# Altium schematic sheet [12] - REFERENCE CLOCKS.SchDoc
size A3; DocumentNumber: 12; SheetNumber: 12; SheetTotal: 15
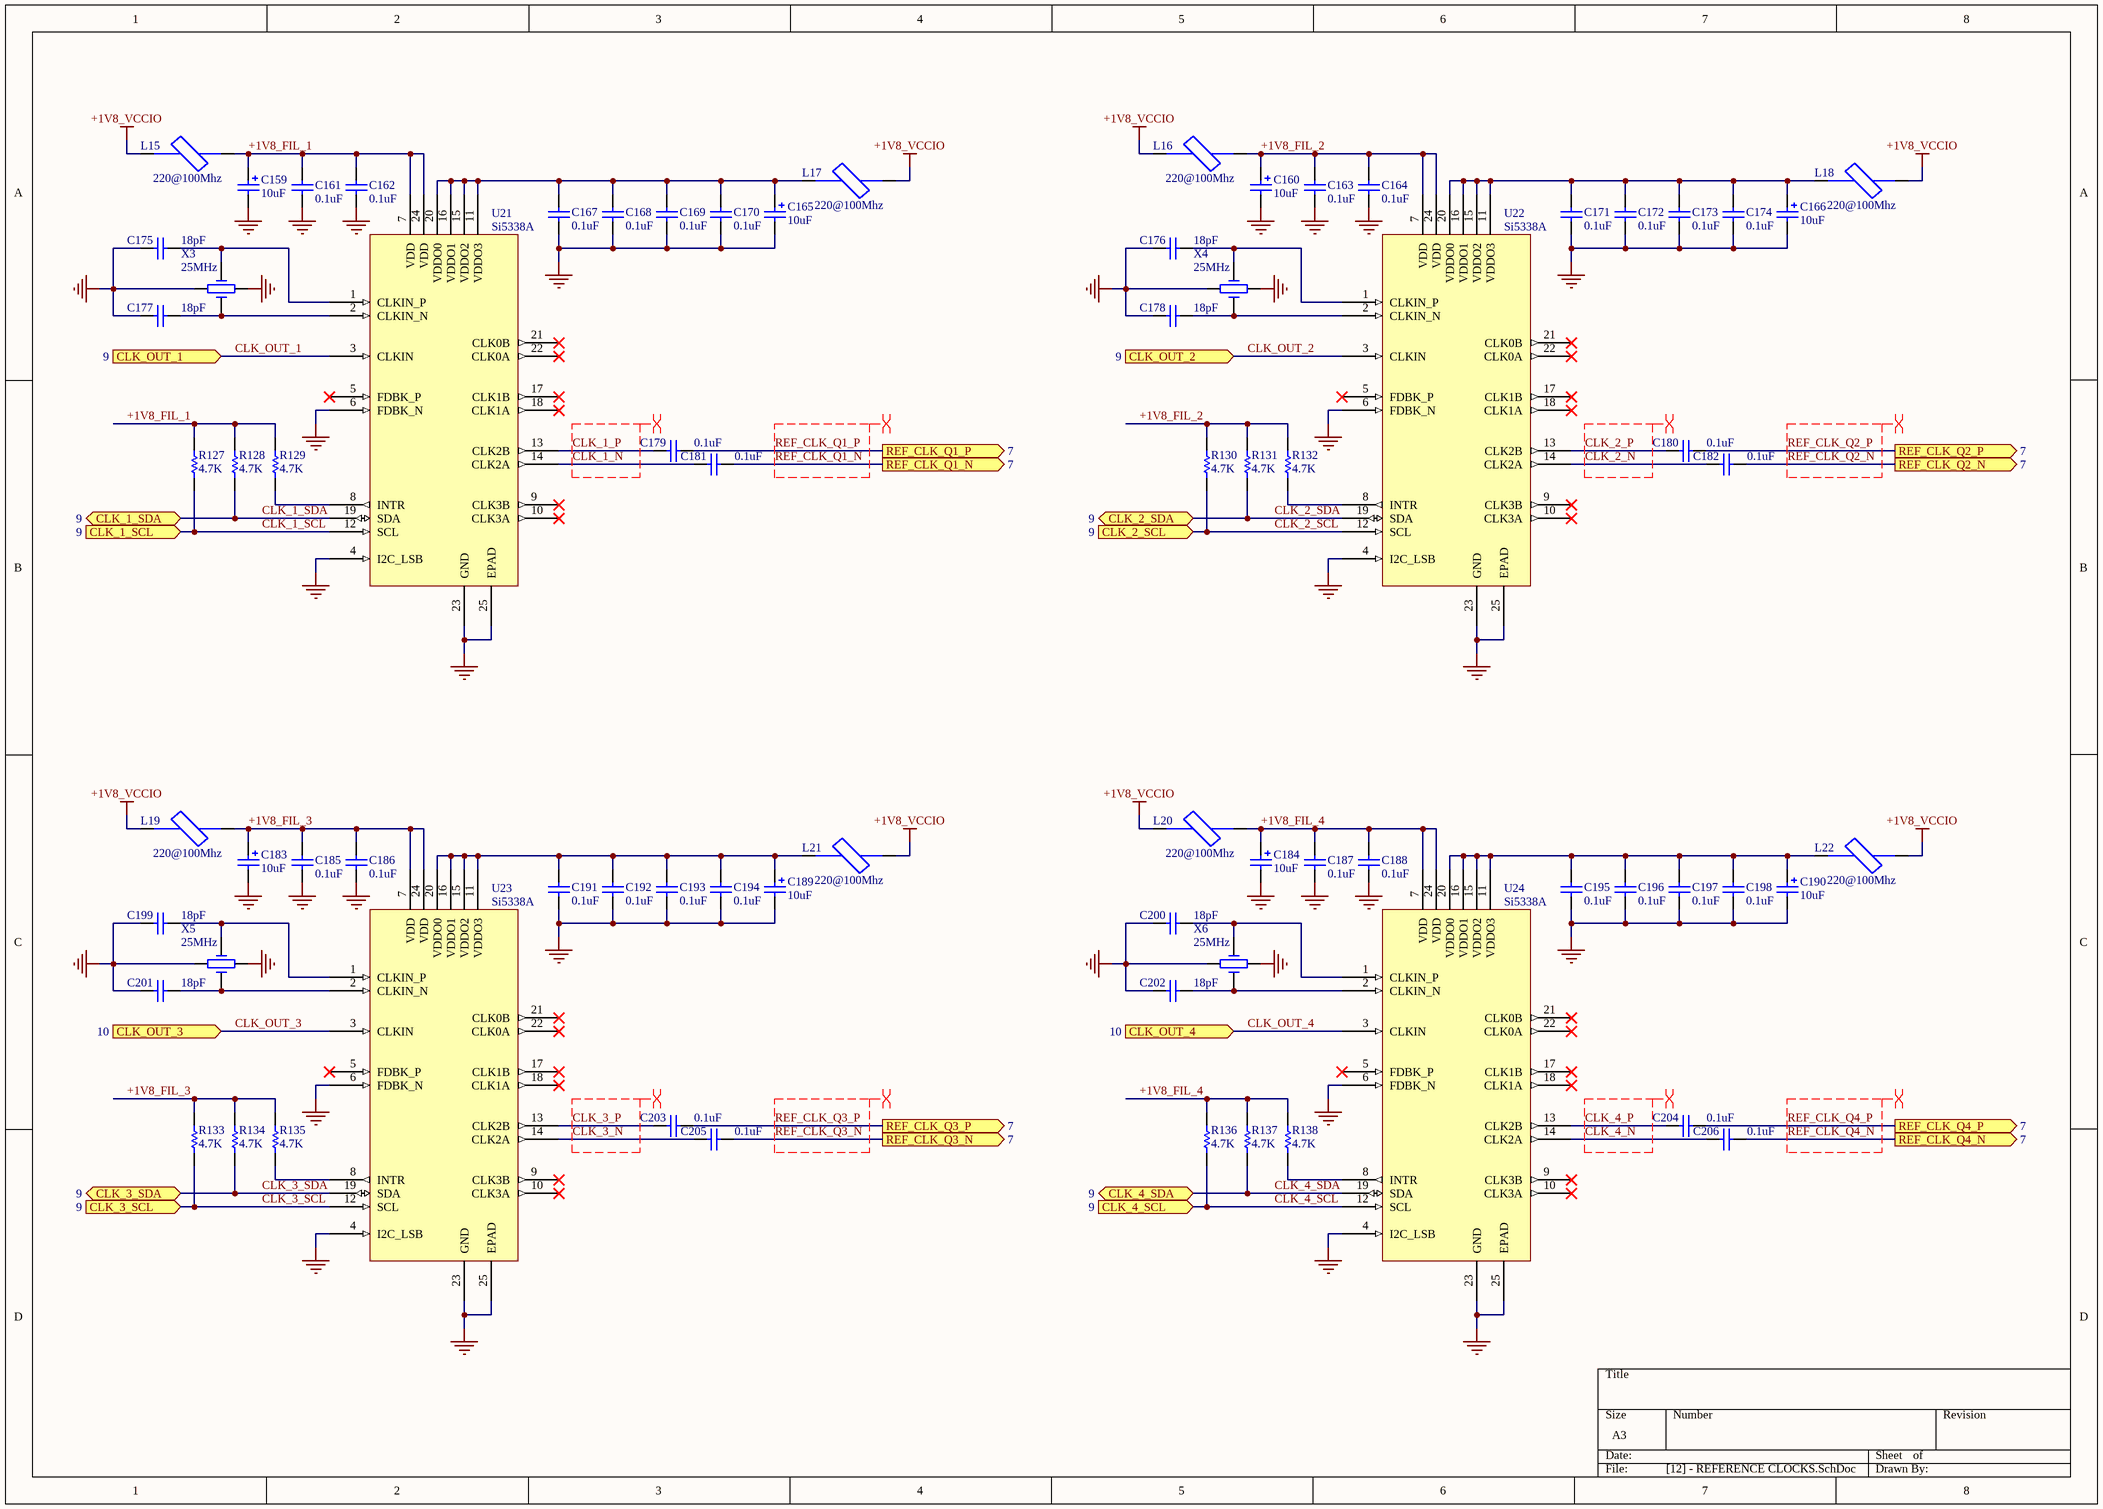
[diagram p0: [12] - REFERENCE CLOCKS.SchDoc]

## Parts
C159  10uF  [TANT_B]
C160  10uF  [TANT_B]
C161  0.1uF  [0402_C]
C162  0.1uF  [0402_C]
C163  0.1uF  [0402_C]
C164  0.1uF  [0402_C]
C165  10uF  [TANT_B]
C166  10uF  [TANT_B]
C167  0.1uF  [0402_C]
C168  0.1uF  [0402_C]
C169  0.1uF  [0402_C]
C170  0.1uF  [0402_C]
C171  0.1uF  [0402_C]
C172  0.1uF  [0402_C]
C173  0.1uF  [0402_C]
C174  0.1uF  [0402_C]
C175  18pF  [0402_C]
C176  18pF  [0402_C]
C177  18pF  [0402_C]
C178  18pF  [0402_C]
C179  0.1uF  [0402_C]
C180  0.1uF  [0402_C]
C181  0.1uF  [0402_C]
C182  0.1uF  [0402_C]
C183  10uF  [TANT_B]
C184  10uF  [TANT_B]
C185  0.1uF  [0402_C]
C186  0.1uF  [0402_C]
C187  0.1uF  [0402_C]
C188  0.1uF  [0402_C]
C189  10uF  [TANT_B]
C190  10uF  [TANT_B]
C191  0.1uF  [0402_C]
C192  0.1uF  [0402_C]
C193  0.1uF  [0402_C]
C194  0.1uF  [0402_C]
C195  0.1uF  [0402_C]
C196  0.1uF  [0402_C]
C197  0.1uF  [0402_C]
C198  0.1uF  [0402_C]
C199  18pF  [0402_C]
C200  18pF  [0402_C]
C201  18pF  [0402_C]
C202  18pF  [0402_C]
C203  0.1uF  [0402_C]
C204  0.1uF  [0402_C]
C205  0.1uF  [0402_C]
C206  0.1uF  [0402_C]
L15  220@100Mhz  [0805_L]
L16  220@100Mhz  [0805_L]
L17  220@100Mhz  [0805_L]
L18  220@100Mhz  [0805_L]
L19  220@100Mhz  [0805_L]
L20  220@100Mhz  [0805_L]
L21  220@100Mhz  [0805_L]
L22  220@100Mhz  [0805_L]
R127  4.7K  [0402_R]
R128  4.7K  [0402_R]
R129  4.7K  [0402_R]
R130  4.7K  [0402_R]
R131  4.7K  [0402_R]
R132  4.7K  [0402_R]
R133  4.7K  [0402_R]
R134  4.7K  [0402_R]
R135  4.7K  [0402_R]
R136  4.7K  [0402_R]
R137  4.7K  [0402_R]
R138  4.7K  [0402_R]
U21  Si5338A
U22  Si5338A
U23  Si5338A
U24  Si5338A
X3  25MHz  [OSC_3.2x2.5]
X4  25MHz  [OSC_3.2x2.5]
X5  25MHz  [OSC_3.2x2.5]
X6  25MHz  [OSC_3.2x2.5]

## Ports
CLK_1_SCL (in, see 9), CLK_1_SDA (bidir, see 9), CLK_2_SCL (in, see 9), CLK_2_SDA (bidir, see 9), CLK_3_SCL (in, see 9), CLK_3_SDA (bidir, see 9), CLK_4_SCL (in, see 9), CLK_4_SDA (bidir, see 9), CLK_OUT_1 (in, see 9), CLK_OUT_2 (in, see 9), CLK_OUT_3 (in, see 10), CLK_OUT_4 (in, see 10), REF_CLK_Q1_N (out, see 7), REF_CLK_Q1_P (out, see 7), REF_CLK_Q2_N (out, see 7), REF_CLK_Q2_P (out, see 7), REF_CLK_Q3_N (out, see 7), REF_CLK_Q3_P (out, see 7), REF_CLK_Q4_N (out, see 7), REF_CLK_Q4_P (out, see 7)

## Nets
+1V8_VCCIO: L15.1 L16.1 L17.2 L18.2 L19.1 L20.1 L21.2 L22.2
GND: C159.2 C160.2 C161.1 C162.1 C163.1 C164.1 C165.2 C166.2 C167.1 C168.1 C169.1 C170.1 C171.1 C172.1 C173.1 C174.1 C175.1 C176.1 C177.1 C178.1 C183.2 C184.2 C185.1 C186.1 C187.1 C188.1 C189.2 C190.2 C191.1 C192.1 C193.1 C194.1 C195.1 C196.1 C197.1 C198.1 C199.1 C200.1 C201.1 C202.1 U21.4(I2C_LSB) U21.6(FDBK_N) U21.23(GND) U21.25(EPAD) U22.4(I2C_LSB) U22.6(FDBK_N) U22.23(GND) U22.25(EPAD) U23.4(I2C_LSB) U23.6(FDBK_N) U23.23(GND) U23.25(EPAD) U24.4(I2C_LSB) U24.6(FDBK_N) U24.23(GND) U24.25(EPAD) X3.2(GND1) X3.4(GND2) X4.2(GND1) X4.4(GND2) X5.2(GND1) X5.4(GND2) X6.2(GND1) X6.4(GND2)
+1V8_FIL_1: C159.1 C161.2 C162.2 L15.2 R127.2 R128.2 R129.2 U21.7(VDD) U21.24(VDD)
+1V8_FIL_2: C160.1 C163.2 C164.2 L16.2 R130.2 R131.2 R132.2 U22.7(VDD) U22.24(VDD)
+1V8_FIL_3: C183.1 C185.2 C186.2 L19.2 R133.2 R134.2 R135.2 U23.7(VDD) U23.24(VDD)
+1V8_FIL_4: C184.1 C187.2 C188.2 L20.2 R136.2 R137.2 R138.2 U24.7(VDD) U24.24(VDD)
CLK_1_N: C181.1 U21.14(CLK2A)
CLK_1_P: C179.1 U21.13(CLK2B)
CLK_1_SCL: R127.1 U21.12(SCL) ; port CLK_1_SCL
CLK_1_SDA: R128.1 U21.19(SDA) ; port CLK_1_SDA
CLK_2_N: C182.1 U22.14(CLK2A)
CLK_2_P: C180.1 U22.13(CLK2B)
CLK_2_SCL: R130.1 U22.12(SCL) ; port CLK_2_SCL
CLK_2_SDA: R131.1 U22.19(SDA) ; port CLK_2_SDA
CLK_3_N: C205.1 U23.14(CLK2A)
CLK_3_P: C203.1 U23.13(CLK2B)
CLK_3_SCL: R133.1 U23.12(SCL) ; port CLK_3_SCL
CLK_3_SDA: R134.1 U23.19(SDA) ; port CLK_3_SDA
CLK_4_N: C206.1 U24.14(CLK2A)
CLK_4_P: C204.1 U24.13(CLK2B)
CLK_4_SCL: R136.1 U24.12(SCL) ; port CLK_4_SCL
CLK_4_SDA: R137.1 U24.19(SDA) ; port CLK_4_SDA
CLK_OUT_1: U21.3(CLKIN) ; port CLK_OUT_1
CLK_OUT_2: U22.3(CLKIN) ; port CLK_OUT_2
CLK_OUT_3: U23.3(CLKIN) ; port CLK_OUT_3
CLK_OUT_4: U24.3(CLKIN) ; port CLK_OUT_4
REF_CLK_Q1_N: C181.2 ; port REF_CLK_Q1_N
REF_CLK_Q1_P: C179.2 ; port REF_CLK_Q1_P
REF_CLK_Q2_N: C182.2 ; port REF_CLK_Q2_N
REF_CLK_Q2_P: C180.2 ; port REF_CLK_Q2_P
REF_CLK_Q3_N: C205.2 ; port REF_CLK_Q3_N
REF_CLK_Q3_P: C203.2 ; port REF_CLK_Q3_P
REF_CLK_Q4_N: C206.2 ; port REF_CLK_Q4_N
REF_CLK_Q4_P: C204.2 ; port REF_CLK_Q4_P
NetC165_1: C165.1 C167.2 C168.2 C169.2 C170.2 L17.1 U21.11(VDDO3) U21.15(VDDO2) U21.16(VDDO1) U21.20(VDDO0)
NetC166_1: C166.1 C171.2 C172.2 C173.2 C174.2 L18.1 U22.11(VDDO3) U22.15(VDDO2) U22.16(VDDO1) U22.20(VDDO0)
NetC175_2: C175.2 U21.1(CLKIN_P) X3.1(OSC1)
NetC176_2: C176.2 U22.1(CLKIN_P) X4.1(OSC1)
NetC177_2: C177.2 U21.2(CLKIN_N) X3.3(OSC2)
NetC178_2: C178.2 U22.2(CLKIN_N) X4.3(OSC2)
NetC189_1: C189.1 C191.2 C192.2 C193.2 C194.2 L21.1 U23.11(VDDO3) U23.15(VDDO2) U23.16(VDDO1) U23.20(VDDO0)
NetC190_1: C190.1 C195.2 C196.2 C197.2 C198.2 L22.1 U24.11(VDDO3) U24.15(VDDO2) U24.16(VDDO1) U24.20(VDDO0)
NetC199_2: C199.2 U23.1(CLKIN_P) X5.1(OSC1)
NetC200_2: C200.2 U24.1(CLKIN_P) X6.1(OSC1)
NetC201_2: C201.2 U23.2(CLKIN_N) X5.3(OSC2)
NetC202_2: C202.2 U24.2(CLKIN_N) X6.3(OSC2)
NetR129_1: R129.1 U21.8(INTR)
NetR132_1: R132.1 U22.8(INTR)
NetR135_1: R135.1 U23.8(INTR)
NetR138_1: R138.1 U24.8(INTR)

Not connected (* = marked no-connect by the designer): U21 5(FDBK_P)* 9(CLK3B)* 10(CLK3A)* 17(CLK1B)* 18(CLK1A)* 21(CLK0B)* 22(CLK0A)*; U22 5(FDBK_P)* 9(CLK3B)* 10(CLK3A)* 17(CLK1B)* 18(CLK1A)* 21(CLK0B)* 22(CLK0A)*; U23 5(FDBK_P)* 9(CLK3B)* 10(CLK3A)* 17(CLK1B)* 18(CLK1A)* 21(CLK0B)* 22(CLK0A)*; U24 5(FDBK_P)* 9(CLK3B)* 10(CLK3A)* 17(CLK1B)* 18(CLK1A)* 21(CLK0B)* 22(CLK0A)*

## Layout directives
differential pair; differential pair class DIFF100: CLK_1_N, CLK_1_P, CLK_2_N, CLK_2_P, CLK_3_N, CLK_3_P, CLK_4_N, CLK_4_P, REF_CLK_Q1_N, REF_CLK_Q1_P, REF_CLK_Q2_N, REF_CLK_Q2_P, REF_CLK_Q3_N, REF_CLK_Q3_P, REF_CLK_Q4_N, REF_CLK_Q4_P

## Library data of the parts
C159 C160 C165 C166 C183 C184 C189 C190 = Cap Tant: Tantalum Polarized Capacitor; RATED_VOLTAGE: 6.3V; Value: 10uF
C161-C164 C167-C182 C185-C188 C191-C206 = Cap SMD: Non-Pol SMD Capacitor; RATED_VOLTAGE: 16V; Manufacturer Part Num: *; Dielectric: *
  C161-C164 C167-C174 C179-C182 C185-C188 C191-C198 C203-C206: Value: 0.1uF
  C175-C178 C199-C202: Value: 18pF
L15-L22 = Ferrite Bead: Value: 220@100Mhz
R127-R138 = Res SMD: SMD Resistor; Tolerance: 5%; Value: 4.7K; Manufacturer Part Num: *
U21-U24 = Si5338: I2C-Programmable Any-Frequency, Any-Output Quad Clock Generator; Value: Si5338A; Manufacturer Part Num: *
X3-X6 = XTAL 4pin: 4-pin SMD Crystal; Manufacturer Part Num: ABM3B-25.000MHZ-D2Y-T; Value: 25MHz